# EAGLE schematic 3pinDXL-data (EAGLE 9.6.2)
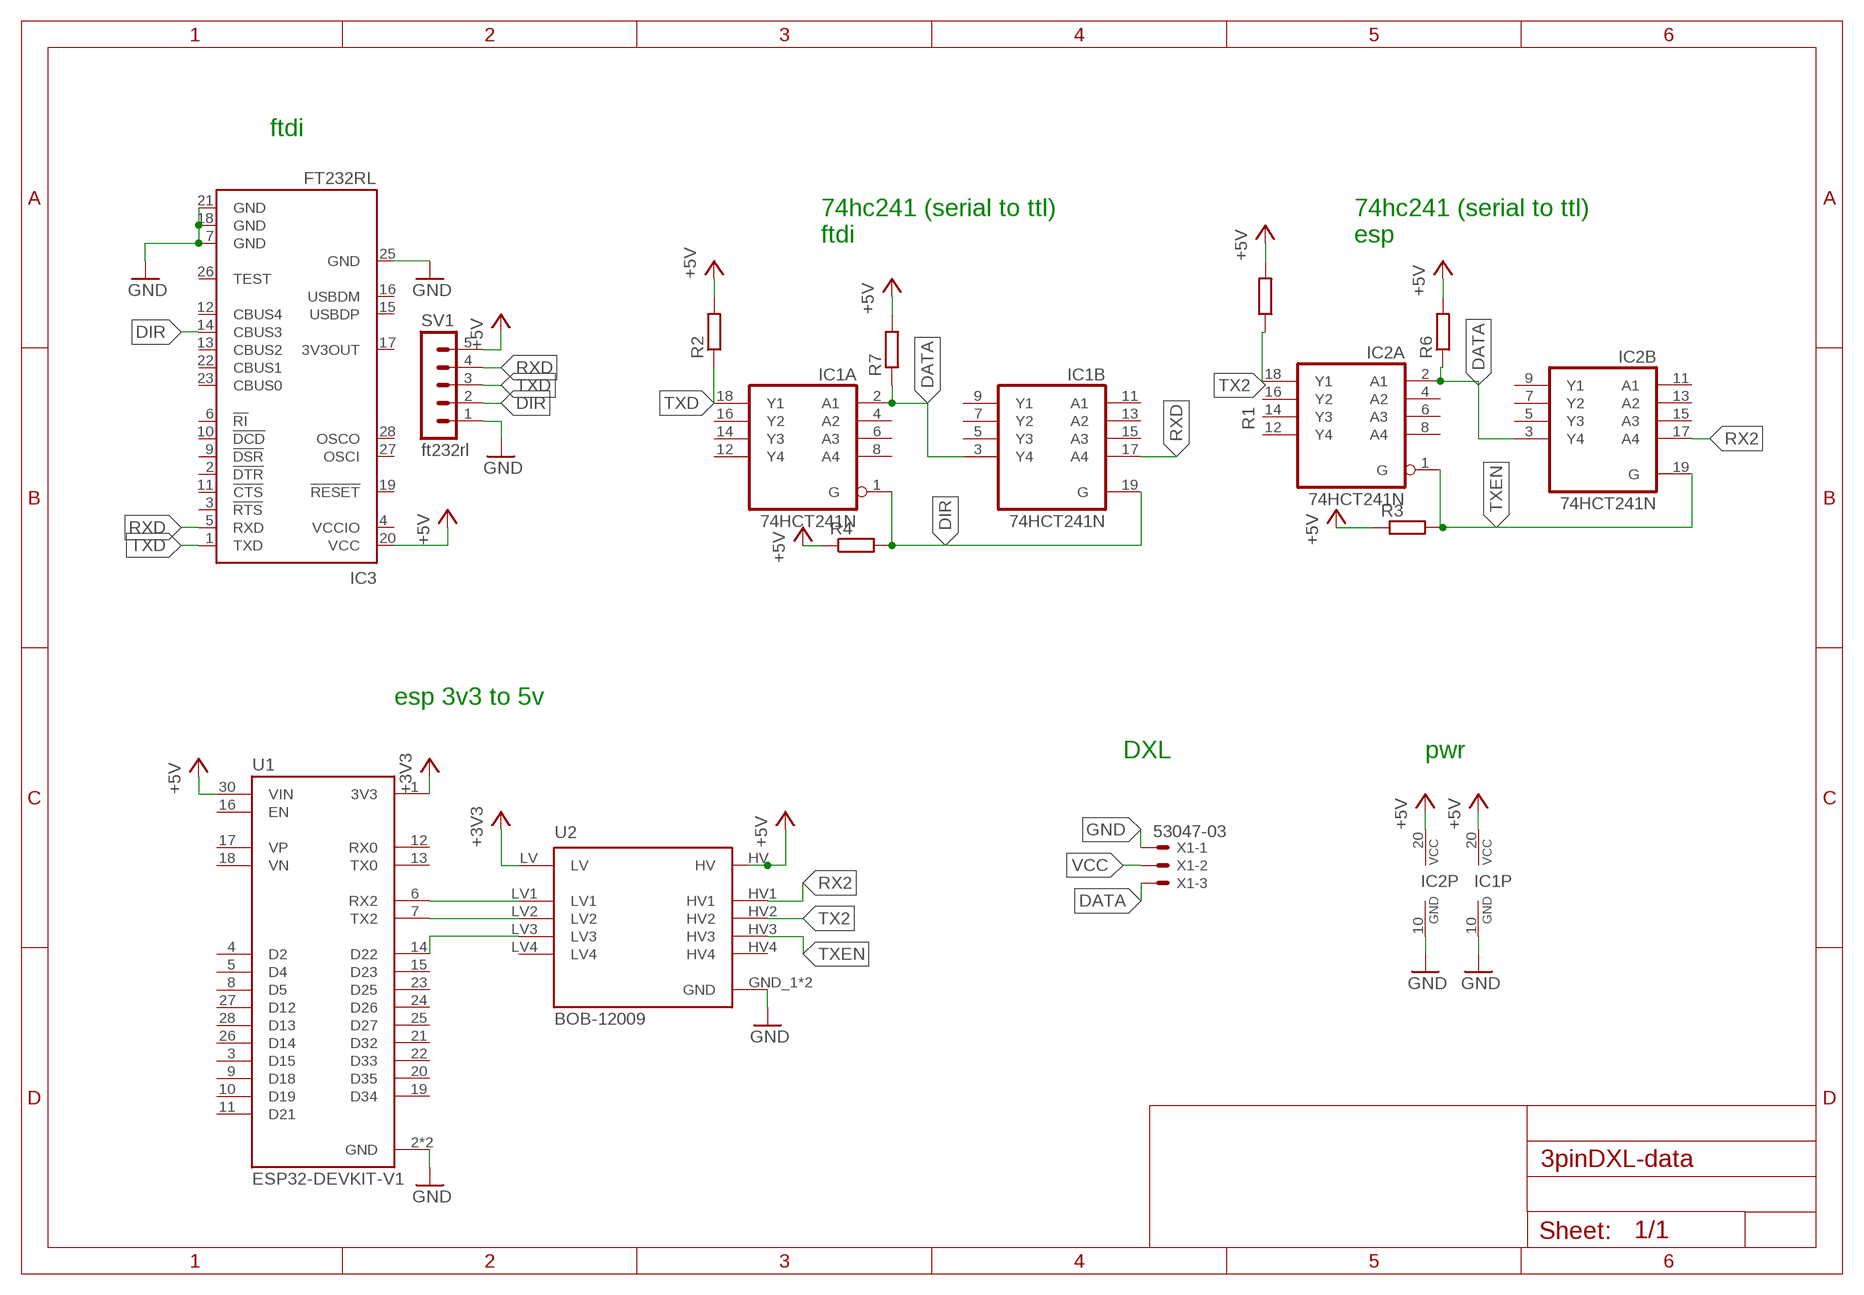
[diagram p0: schematic, sheet 1]

## Parts
IC1  74HCT241N  [DIL20]
IC2  74HCT241N  [DIL20]
IC3  FT232RL  [SSOP28]
R1  R-EU_R0805  [R0805]
R2  R-EU_R0805  [R0805]
R3  R-EU_R0805  [R0805]
R4  R-EU_R0805  [R0805]
R6  R-EU_R0805  [R0805]
R7  R-EU_R0805  [R0805]
SV1  ft232rl  MA05-1  [MA05-1]
U1  ESP32-DEVKIT-V1  [MODULE_ESP32_DEVKIT_V1]
U2  BOB-12009  [CONV_BOB-12009]
X1  53047-03  [53047-03]

## Nets
+3V3: U1.1(3V3) U2.LV
+5V: IC1.20(P:VCC) IC2.20(P:VCC) IC3.20(VCC) R1.2 R2.2 R3.1 R4.1 R6.2 R7.2 SV1.5 U1.30(VIN) U2.HV
DATA: IC1.2(A:A1) IC1.3(B:Y4) IC2.2(A:A1) IC2.3(B:Y4) R6.1 R7.1 X1.3
DIR: IC1.1(A:G) IC1.19(B:G) IC3.14(CBUS3) R4.2 SV1.2
GND: IC1.10(P:GND) IC2.10(P:GND) IC3.7(GND) IC3.18(GND) IC3.21(GND) IC3.25(GND) SV1.1 U1.2(GND) U1.29(GND) U2.GND_1(GND) U2.GND_2(GND) X1.1
N$3: U1.6(RX2) U2.LV1
N$4: U1.7(TX2) U2.LV2
N$10: U1.14(D22) U2.LV3
RX2: IC2.17(B:A4) U2.HV1
RXD: IC1.17(B:A4) IC3.5(RXD) SV1.4
TX2: IC2.18(A:Y1) R1.1 U2.HV2
TXD: IC1.18(A:Y1) IC3.1(TXD) R2.1 SV1.3
TXEN: IC2.1(A:G) IC2.19(B:G) R3.2 U2.HV3
VCC: X1.2
Unconnected: IC1.4(A:A2) IC1.5(B:Y3) IC1.6(A:A3) IC1.7(B:Y2) IC1.8(A:A4) IC1.9(B:Y1) IC1.11(B:A1) IC1.12(A:Y4) IC1.13(B:A2) IC1.14(A:Y3) IC1.15(B:A3) IC1.16(A:Y2) IC2.4(A:A2) IC2.5(B:Y3) IC2.6(A:A3) IC2.7(B:Y2) IC2.8(A:A4) IC2.9(B:Y1) IC2.11(B:A1) IC2.12(A:Y4) IC2.13(B:A2) IC2.14(A:Y3) IC2.15(B:A3) IC2.16(A:Y2) IC3.2(!DTR) IC3.3(!RTS) IC3.6(!RI) IC3.9(!DSR) IC3.10(!DCD) IC3.11(!CTS) IC3.12(CBUS4) IC3.13(CBUS2) IC3.15(USBDP) IC3.16(USBDM) IC3.17(3V3OUT) IC3.19(!RESET) IC3.22(CBUS1) IC3.23(CBUS0) IC3.26(TEST) IC3.27(OSCI) IC3.28(OSCO) U1.3(D15) U1.4(D2) U1.5(D4) U1.8(D5) U1.9(D18) U1.10(D19) U1.11(D21) U1.12(RX0) U1.13(TX0) U1.15(D23) U1.16(EN) U1.17(VP) U1.18(VN) U1.19(D34) U1.20(D35) U1.21(D32) U1.22(D33) U1.23(D25) U1.24(D26) U1.25(D27) U1.26(D14) U1.27(D12) U1.28(D13) U2.HV4 U2.LV4

## Notes on the sheet
- ftdi
- 74hc241 (serial to ttl)
  ftdi
- 74hc241 (serial to ttl)
  esp
- esp 3v3 to 5v
- DXL | pwr

## Power pins joined to a net without a drawn wire
VCCIO: IC3.4(VCCIO)

## Library data of the parts
IC1 IC2 = 74xx-eu:74*241: Octal BUFFER and LINE DRIVER, 3-state
IC3 = ftdichip:FT232R: Source: http://www.ftdichip.com/Documents/DataSheets/DS_FT232R_v104.pdf; MPN: FT232RL; OC_FARNELL: 1146032; OC_NEWARK: 91K9918
R1-R4 R6 R7 = rcl:R-EU_: RESISTOR, European symbol; SPICEPREFIX: R
SV1 = con-lstb:MA05-1: PIN HEADER; OC_FARNELL: unknown; OC_NEWARK: unknown
U1 = ESP32-DEVKIT-V1:ESP32-DEVKIT-V1: Dual core, Wi-Fi: 2.4 GHz up to 150 Mbits/s,BLE (Bluetooth Low Energy) and legacy Bluetooth, 32 bits, Up to 240 MHz Check availability <https://pricing.snapeda.com/parts/ESP32-DEVKIT-V1/Do%20it/view-part?ref=eda>; AVAILABILITY: Not in stock; DESCRIPTION: Dual core, Wi-Fi: 2.4 GHz up to 150 Mbits/s,BLE (Bluetooth Low Energy) and legacy Bluetooth, 32 bits, Up to 240 MHz; MF: Do it; MP: ESP32-DEVKIT-V1; PACKAGE: None; PRICE: None
U2 = BOB-12009:BOB-12009: Logic Level Converter - Bi-Direc Check availability <https://pricing.snapeda.com/parts/BOB-12009/SparkFun/view-part?ref=eda>; AVAILABILITY: In Stock; DESCRIPTION: BSS138 Logic-Level Translator Interface Evaluation Board; MF: SparkFun; MP: BOB-12009; PACKAGE: None; PRICE: None; PURCHASE-URL: https://pricing.snapeda.com/search/part/BOB-12009/?ref=eda
X1 = con-molex:53?-03: CONNECTOR wire to board 1.25 mm (.049 inch) pitch header; MF: MOLEX; MPN: 530470310; OC_FARNELL: 9732853; OC_NEWARK: 14R5412